# Altium schematic sheet PowerMergeBoard.SchDoc
size A
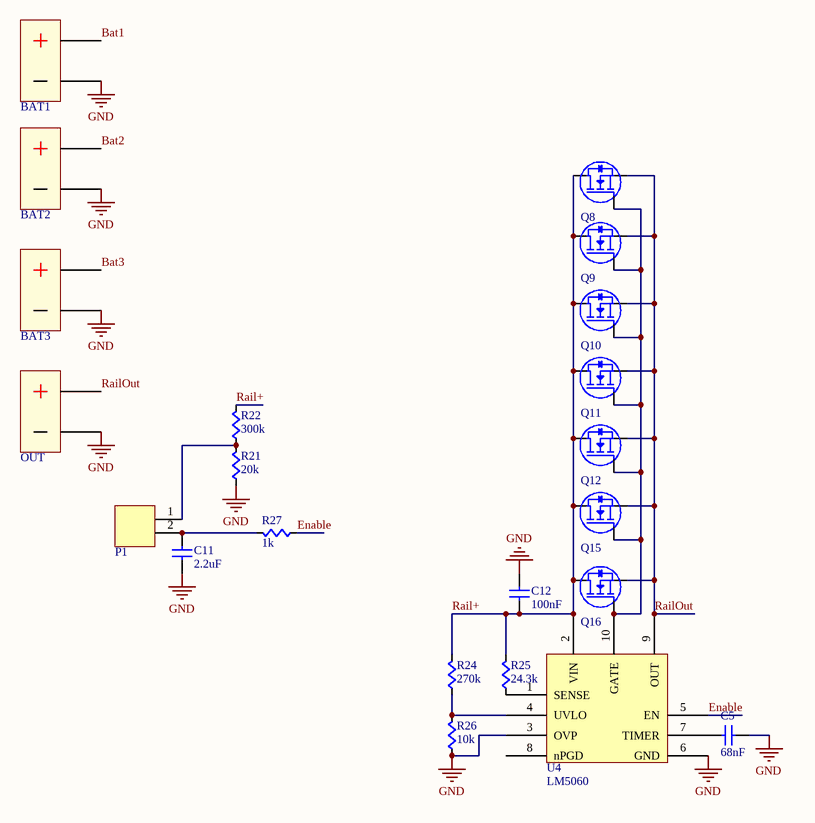
[diagram p0: PowerMergeBoard.SchDoc]

## Parts
BAT1  BATWIRE  [BATWIRE10]  (value not drawn)
BAT2  BATWIRE  [BATWIRE10]  (value not drawn)
BAT3  BATWIRE  [BATWIRE10]  (value not drawn)
C5  value 68nF  [CAPC0603]  (hidden comment: Cap)
C11  value 2.2uF  [CAPC1206]  (hidden comment: Cap)
C12  value 100nF  [CAPC0603]  (hidden comment: Cap)
OUT  BATWIRE  [BATWIRE10]  (value not drawn)
P1  2-pin Vert Sherlock  [MOLEX-HDR-1X2-SHERLOCK-VERT]  (value not drawn)
Q8  CSD19502Q5B  [CSD19502Q5B]  (value not drawn)
Q9  CSD19502Q5B  [CSD19502Q5B]  (value not drawn)
Q10  CSD19502Q5B  [CSD19502Q5B]  (value not drawn)
Q11  CSD19502Q5B  [CSD19502Q5B]  (value not drawn)
Q12  CSD19502Q5B  [CSD19502Q5B]  (value not drawn)
Q15  CSD19502Q5B  [CSD19502Q5B]  (value not drawn)
Q16  CSD19502Q5B  [CSD19502Q5B]  (value not drawn)
R21  value 20k  [RES0603]  (hidden comment: Res)
R22  value 300k  [RES0603]  (hidden comment: Res)
R24  value 270k  [RES0603]  (hidden comment: Res)
R25  value 24.3k  [RES0603]  (hidden comment: Res)
R26  value 10k  [RES0603]  (hidden comment: Res)
R27  value 1k  [RES0603]  (hidden comment: Res)
U4  LM5060  [LM5060]

## Nets
GND: BAT1.- BAT2.- BAT3.- C5.2(B) C11.2(B) C12.1(A) OUT.- R21.2(B) R26.2(B) U4.3(OVP) U4.6(GND)
Bat1: BAT1.+
Bat2: BAT2.+
Bat3: BAT3.+
Enable: R27.2(B) U4.5(EN)
Rail+: C12.2(B) Q8.D Q9.D Q10.D Q11.D Q12.D Q15.D Q16.D R22.1(A) R24.1(A) R25.1(A) U4.2(VIN)
RailOut: OUT.+ Q8.S Q9.S Q10.S Q11.S Q12.S Q15.S Q16.S U4.9(OUT)
NetC5_1: C5.1(A) U4.7(TIMER)
NetC11_1: C11.1(A) P1.2 R27.1(A)
NetP1_1: P1.1 R21.1(A) R22.2(B)
NetQ8_G: Q8.G Q9.G Q10.G Q11.G Q12.G Q15.G Q16.G U4.10(GATE)
NetR24_2: R24.2(B) R26.1(A) U4.4(UVLO)
NetR25_2: R25.2(B) U4.1(SENSE)

Not connected (* = marked no-connect by the designer): U4 8(nPGD)

## Library data of the parts
BAT1-BAT3 OUT = BATWIRE: Two large gauge leads soldered directly to the board.
P1 = MOLEX-HDR-1x2-SHERLOCK_VERT: Header, Molex, 2mm Pitch Sherlock Header, Single Row, Vertical, 2 Circuits, Length 3.3mm, 0353620250; Manufacturer Part Number: *; Order Part Number: *
Q8-Q12 Q15 Q16 = CSD19502Q5B: NEXFET Power MOSFET; Supplier 1: Digi-Key; Supplier Part Number 1: 296-37194-1-ND
U4 = LM5060: Hotswap Controller; Supplier 1: Digi-Key; Supplier Part Number 1: LM5060Q1MM/NOPBCT-ND
C5 C11 C12 = Cap: Supplier 1: Digi-Key
  C5: Supplier Part Number 1: 1276-2112-1-ND
  C11: Supplier Part Number 1: 445-5207-1-ND
  C12: Supplier Part Number 1: 1276-1000-1-ND
R21 R22 R24-R27 = Res: Supplier 1: Digi-Key
  R24: Supplier Part Number 1: RHM270KCFCT-ND
  R25: Supplier Part Number 1: RMCF0603FT24K3CT-ND
  R26: Supplier Part Number 1: RMCF0603FT10K0CT-ND
  R27: Supplier Part Number 1: RNCP1206FTD1K00CT-ND